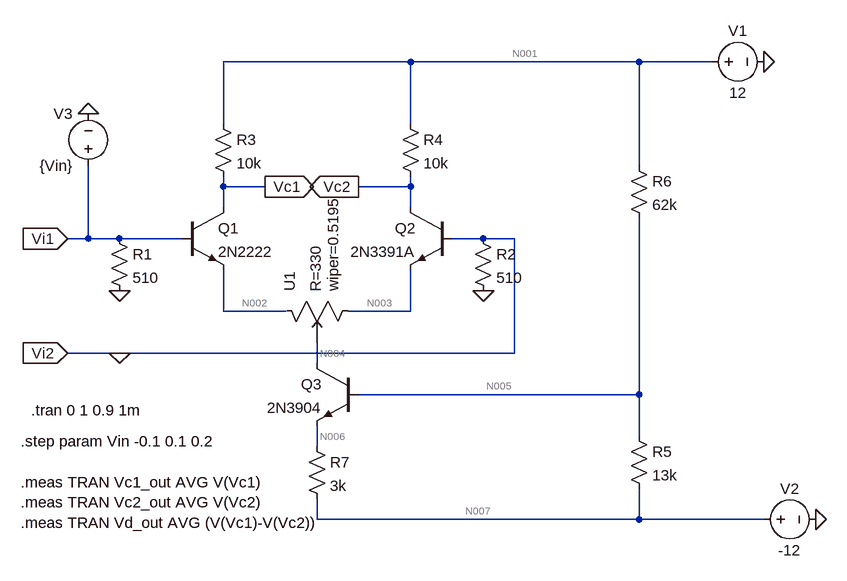
[diagram p0: schematic DifferentialAmplifierCircuit_single_input.asc]
DifferentialAmplifierCircuit_single_input.asc, the LTspice schematic file:
Version 4.1
SHEET 1 884 1616
WIRE 192 -160 -96 -160
WIRE 544 -160 192 -160
WIRE 656 -160 544 -160
WIRE -96 -64 -96 -160
WIRE 192 -64 192 -160
WIRE 544 0 544 -160
WIRE -96 32 -96 16
WIRE -32 32 -96 32
WIRE 192 32 192 16
WIRE 192 32 112 32
WIRE -96 64 -96 32
WIRE 192 64 192 32
WIRE -304 112 -304 0
WIRE -304 112 -336 112
WIRE -256 112 -304 112
WIRE -160 112 -256 112
WIRE 304 112 256 112
WIRE 352 112 304 112
WIRE -96 224 -96 160
WIRE 0 224 -96 224
WIRE 192 224 192 160
WIRE 192 224 96 224
WIRE -256 288 -336 288
WIRE 352 288 352 112
WIRE 352 288 -256 288
WIRE 48 304 48 272
WIRE 544 352 544 80
WIRE 544 352 112 352
WIRE 544 416 544 352
WIRE 48 432 48 400
WIRE 48 544 48 512
WIRE 544 544 544 496
WIRE 544 544 48 544
WIRE 736 544 544 544
FLAG -256 192 0
FLAG 304 192 0
FLAG -336 112 Vi1
IOPIN -336 112 In
FLAG -336 288 Vi2
IOPIN -336 288 In
FLAG -32 32 Vc1
IOPIN -32 32 Out
FLAG 112 32 Vc2
IOPIN 112 32 Out
FLAG 736 -160 0
FLAG 816 544 0
FLAG -304 -80 0
FLAG -256 288 0
SYMBOL npn -160 64 R0
SYMATTR InstName Q1
SYMATTR Value 2N2222
SYMBOL npn 256 64 M0
SYMATTR InstName Q2
SYMATTR Value 2N3391A
SYMBOL npn 112 304 M0
SYMATTR InstName Q3
SYMATTR Value 2N3904
SYMBOL res -272 96 R0
SYMATTR InstName R1
SYMATTR Value 510
SYMBOL res 288 96 R0
SYMATTR InstName R2
SYMATTR Value 510
SYMBOL res -112 -80 R0
SYMATTR InstName R3
SYMATTR Value 10k
SYMBOL res 176 -80 R0
SYMATTR InstName R4
SYMATTR Value 10k
SYMBOL res 528 400 R0
SYMATTR InstName R5
SYMATTR Value 13k
SYMBOL res 528 -16 R0
SYMATTR InstName R6
SYMATTR Value 62k
SYMBOL res 32 416 R0
SYMATTR InstName R7
SYMATTR Value 3k
SYMBOL voltage 640 -160 R270
WINDOW 0 32 56 VTop 2
WINDOW 3 -32 56 VBottom 2
WINDOW 123 0 0 Left 0
WINDOW 39 0 0 Left 0
SYMATTR InstName V1
SYMATTR Value 12
SYMBOL voltage 720 544 R270
WINDOW 0 32 56 VTop 2
WINDOW 3 -32 56 VBottom 2
WINDOW 123 0 0 Left 0
WINDOW 39 0 0 Left 0
SYMATTR InstName V2
SYMATTR Value -12
SYMBOL potentiometer 96 224 R270
SYMATTR InstName U1
SYMATTR SpiceLine R=330
SYMATTR SpiceLine2 wiper=0.5195
SYMBOL voltage -304 16 R180
WINDOW 0 24 96 Left 2
WINDOW 3 24 16 Left 2
WINDOW 123 0 0 Left 0
WINDOW 39 0 0 Left 0
SYMATTR InstName V3
SYMATTR Value {Vin}
TEXT -408 424 Left 2 !.step param Vin -0.1 0.1 0.2\n \n.meas TRAN Vc1_out AVG V(Vc1)\n.meas TRAN Vc2_out AVG V(Vc2)\n.meas TRAN Vd_out AVG (V(Vc1)-V(Vc2))
TEXT -392 376 Left 2 !.tran 0 1 0.9 1m

The netlist it stands for:
* DifferentialAmplifierCircuit_single_input.asc
Q1 Vc1 Vi1 N002 0 2N2222
Q2 Vc2 0 N003 0 2N3391A
Q3 N004 N005 N006 0 2N3904
R1 Vi1 0 510
R2 0 0 510
R3 N001 Vc1 10k
R4 N001 Vc2 10k
R5 N005 N007 13k
R6 N001 N005 62k
R7 N006 N007 3k
V1 N001 0 12
V2 N007 0 -12
X§U1 N002 N003 N004 potentiometer R=330 wiper=0.5195  ; pins 1 2 3
V3 Vi1 0 {Vin}
.model NPN NPN
.model PNP PNP
.lib standard.bjt
.step param Vin -0.1 0.1 0.2
.meas TRAN Vc1_out AVG V(Vc1)
.meas TRAN Vc2_out AVG V(Vc2)
.meas TRAN Vd_out AVG (V(Vc1)-V(Vc2))
.tran 0 1 0.9 1m
.lib potentiometer.lib
.backanno
.end

* Results of the author's LTspice run, read from the files saved beside the schematic
* Operating Point (first step), zero values left out:
*   V(vi1) = -100 mV
*   V(vc2) = 3.972 V
*   V(n003) = -642.2 mV
*   V(n005) = -7.879 V
*   V(n007) = -12 V
*   V(vc1) = 8.558 V
*   V(n002) = -725.5 mV
*   V(n004) = -780.3 mV
*   V(n006) = -8.536 V
*   V(n001) = 12 V
*   Ic(Q1) = 344.2 µA
*   Ib(Q1) = 1.585 µA
*   Ie(Q1) = -345.7 µA
*   I(R3) = 344.2 µA
*   I(R5) = 317 µA
*   I(V1) = -1.468 mA
*   Ic(Q3) = 1.151 mA
*   Ib(Q3) = 3.592 µA
*   Ie(Q3) = -1.155 mA
*   Ic(Q2) = 802.8 µA
*   Ib(Q2) = 2.581 µA
*   Ie(Q2) = -805.4 µA
*   I(R4) = 802.8 µA
*   I(R6) = 320.6 µA
*   I(R7) = 1.155 mA
*   I(R1) = -196.1 µA
*   I(V2) = 1.472 mA
*   I(V3) = 194.5 µA
*   Ix(u1:1) = 345.7 µA
*   Ix(u1:2) = 805.4 µA
*   Ix(u1:3) = -1.151 mA
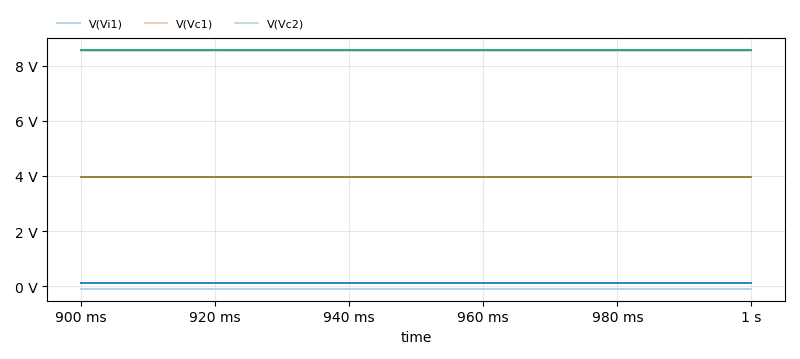
[diagram p1: Transient Analysis of DifferentialAmplifierCircuit_single_input.asc, plotted from the saved traces]
* Transient Analysis, 2 runs:
*   V(Vi1) [vin=-0.1]: min -100 mV, max -100 mV, average -100 mV, rms 100 mV, last -100 mV
*   V(Vi1) [vin=0.1]: min 100 mV, max 100 mV, average 100 mV, rms 100 mV, last 100 mV
*   V(Vc1) [vin=-0.1]: min 8.558 V, max 8.558 V, average 8.558 V, rms 8.558 V, last 8.558 V
*   V(Vc1) [vin=0.1]: min 3.975 V, max 3.975 V, average 3.975 V, rms 3.975 V, last 3.975 V
*   V(Vc2) [vin=-0.1]: min 3.972 V, max 3.972 V, average 3.972 V, rms 3.972 V, last 3.972 V
*   V(Vc2) [vin=0.1]: min 8.564 V, max 8.564 V, average 8.564 V, rms 8.564 V, last 8.564 V
* From the log:
*   Measurement: vc1_out
*     step  AVG(V(Vc1))  FROM  TO
*        1  8.55844497681  0  0.1
*        2  3.97540616989  0  0.1
*   Measurement: vc2_out
*     step  AVG(V(Vc2))  FROM  TO
*        1  3.97197294235  0  0.1
*        2  8.56375694275  0  0.1
*   Measurement: vd_out
*     step  AVG(V(Vc1)-V(Vc2))  FROM  TO
*        1  4.58647203445  0  0.1
*        2  -4.58835077286  0  0.1